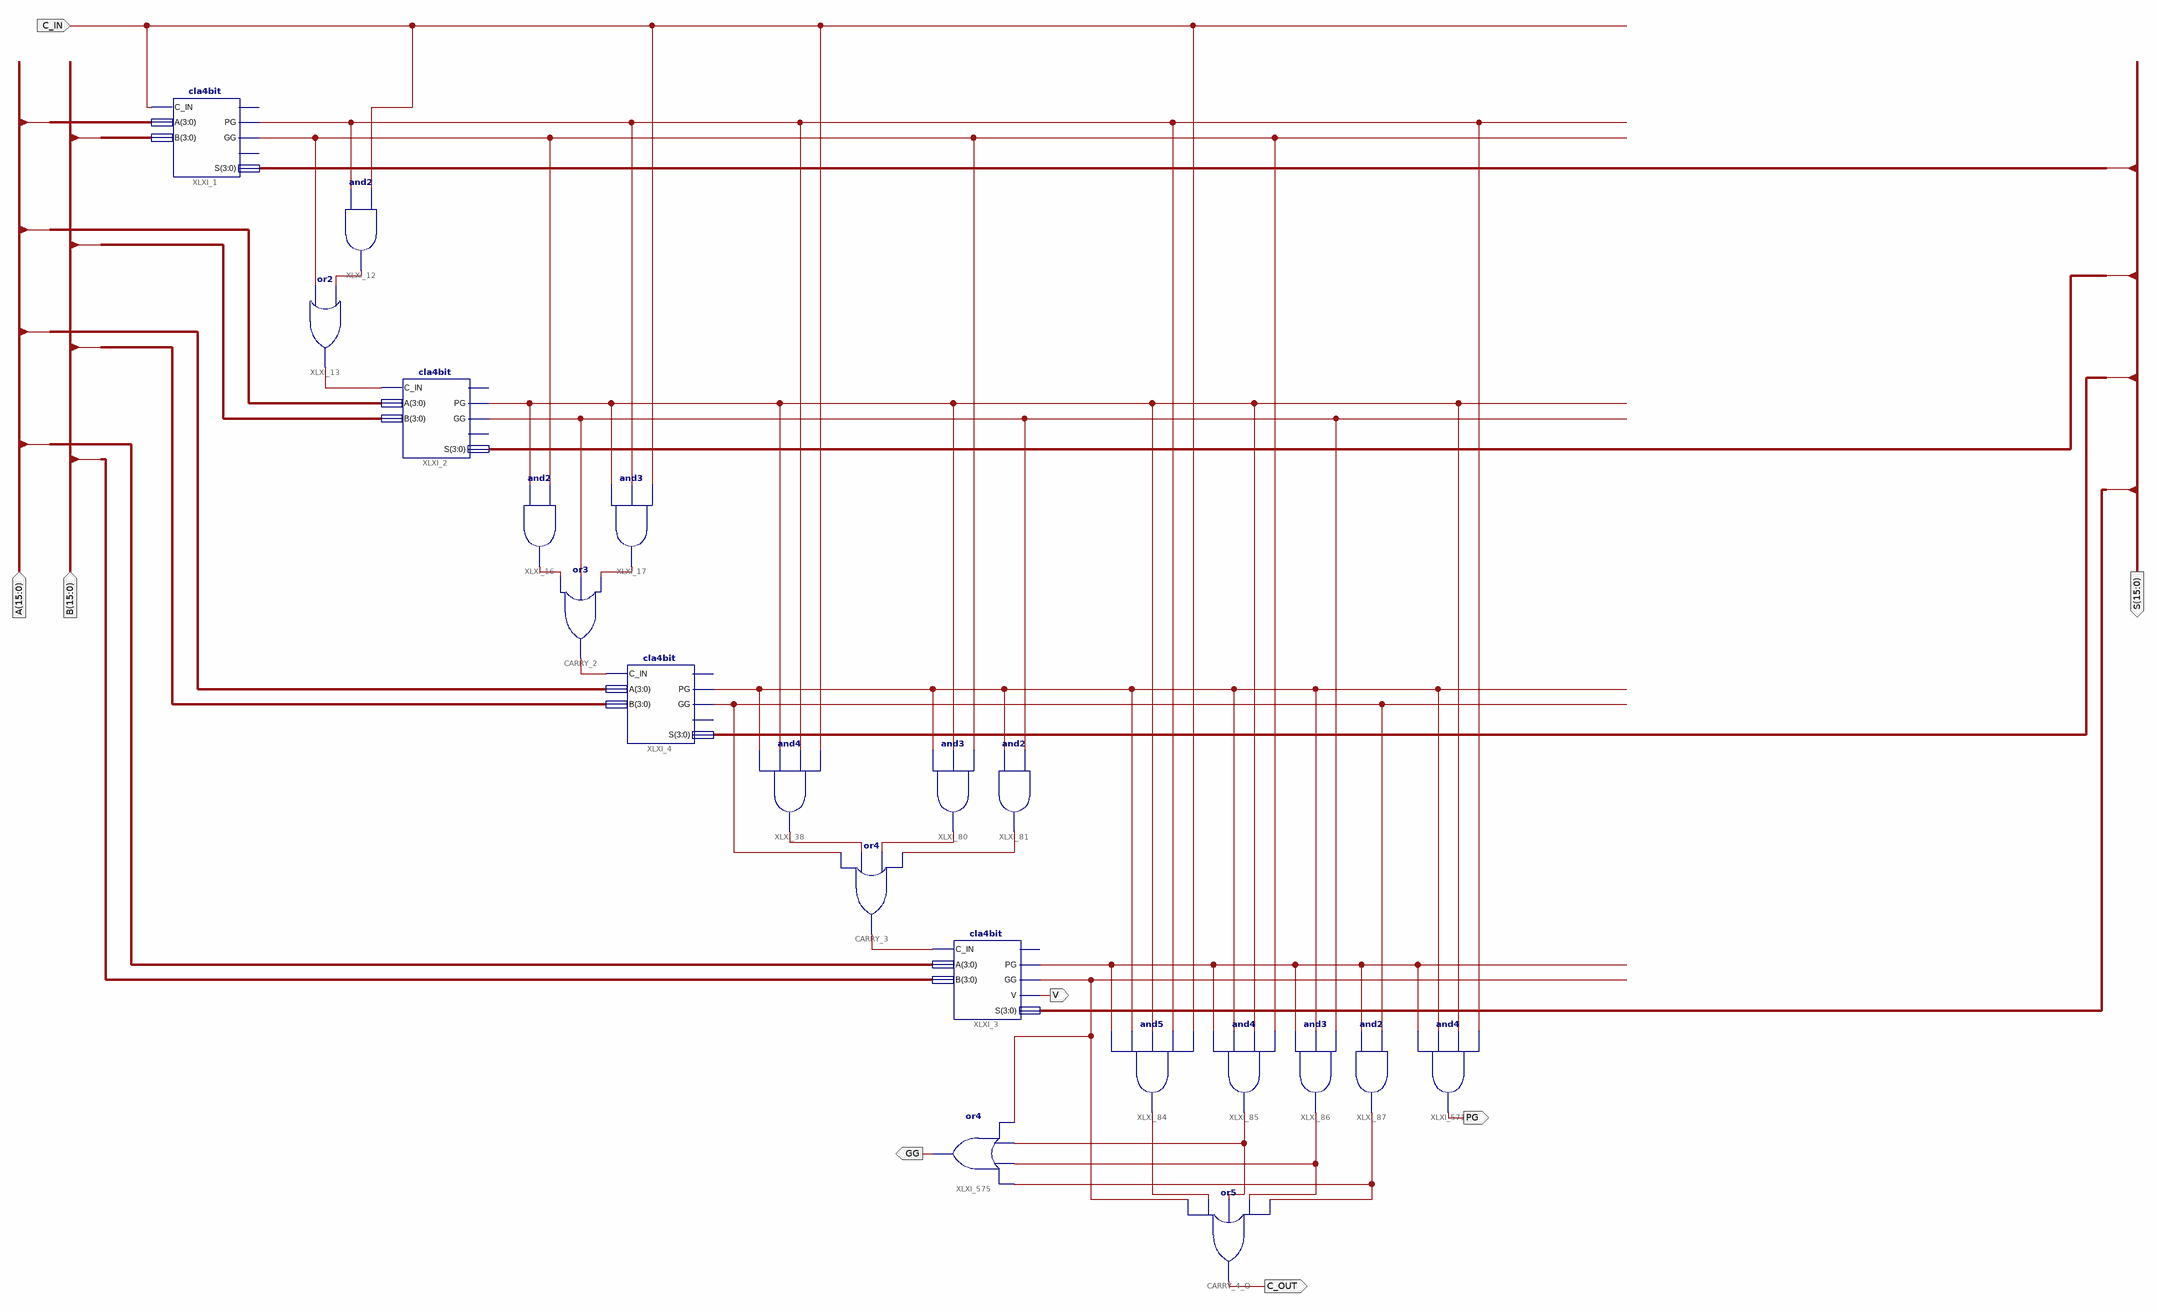
[diagram p0: schematic sheet 1]
// Xilinx ISE schematic cla16bit.sch (spartan3e) as structural Verilog: 20 symbols, 8 ports
module cla16bit (
  input  [15:0] A,
  input  [15:0] B,
  input  C_IN,
  output [15:0] S,
  output V,
  output C_OUT,
  output PG,
  output GG
);

  wire XLXN_28, XLXN_44, XLXN_45, XLXN_69, XLXN_100, XLXN_101, XLXN_108, XLXN_109, XLXN_110, XLXN_111,
       XLXN_112, XLXN_118, XLXN_123, XLXN_124, XLXN_125, XLXN_132, XLXN_135, XLXN_136, XLXN_137, XLXN_138,
       XLXN_139;

  cla4bit XLXI_1 (.C_IN(C_IN), .B(B[3:0]), .A(A[3:0]), .PG(XLXN_28), .GG(XLXN_44), .S(S[3:0]));  // open: V, C_OUT
  cla4bit XLXI_2 (.C_IN(XLXN_69), .B(B[7:4]), .A(A[7:4]), .PG(XLXN_100), .GG(XLXN_101), .S(S[7:4]));  // open: V, C_OUT
  cla4bit XLXI_4 (
    .C_IN(XLXN_108), .B(B[11:8]), .A(A[11:8]), .PG(XLXN_112), .GG(XLXN_111), .S(S[11:8]));  // open: V, C_OUT
  cla4bit XLXI_3 (
    .C_IN(XLXN_118), .B(B[15:12]), .A(A[15:12]), .V(V), .PG(XLXN_132), .GG(XLXN_135), .S(S[15:12]));  // open: C_OUT
  and XLXI_12 (XLXN_45, XLXN_28, C_IN);
  or XLXI_13 (XLXN_69, XLXN_44, XLXN_45);
  or CARRY_2 (XLXN_108, XLXN_109, XLXN_101, XLXN_110);
  and XLXI_16 (XLXN_109, XLXN_100, XLXN_44);
  and XLXI_17 (XLXN_110, XLXN_100, XLXN_28, C_IN);
  or CARRY_3 (XLXN_118, XLXN_111, XLXN_123, XLXN_124, XLXN_125);
  and XLXI_38 (XLXN_123, XLXN_112, XLXN_100, XLXN_28, C_IN);
  and XLXI_80 (XLXN_124, XLXN_112, XLXN_100, XLXN_44);
  and XLXI_81 (XLXN_125, XLXN_112, XLXN_101);
  or CARRY_4_O (C_OUT, XLXN_135, XLXN_136, XLXN_137, XLXN_138, XLXN_139);
  and XLXI_571 (PG, XLXN_132, XLXN_112, XLXN_100, XLXN_28);
  or XLXI_575 (GG, XLXN_135, XLXN_137, XLXN_138, XLXN_139);
  and XLXI_87 (XLXN_139, XLXN_132, XLXN_111);
  and XLXI_86 (XLXN_138, XLXN_132, XLXN_112, XLXN_101);
  and XLXI_85 (XLXN_137, XLXN_132, XLXN_112, XLXN_100, XLXN_44);
  and XLXI_84 (XLXN_136, XLXN_132, XLXN_112, XLXN_100, XLXN_28, C_IN);
endmodule
